# Altium schematic sheet Power.SchDoc
size A4
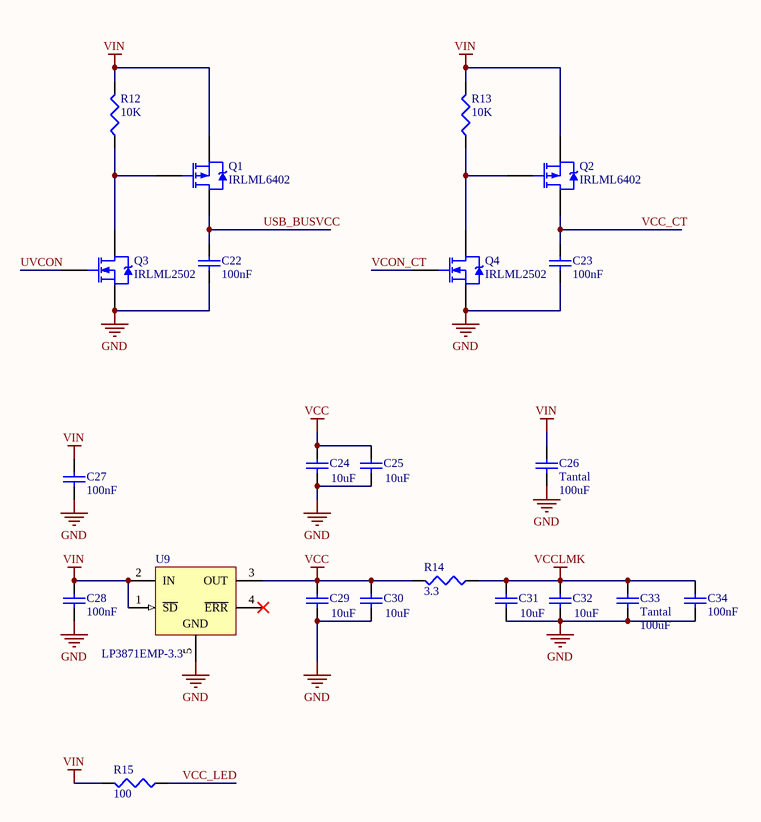
[diagram p0: Power.SchDoc]

## Parts
C22  100nF  [1608[0603]]
C23  100nF  [1608[0603]]
C24  10uF  [C1210]
C25  10uF  [C1210]
C26  Tantal  value 100uF  [C2512]
C27  100nF  [1608[0603]]
C28  100nF  [1608[0603]]
C29  10uF  [C1210]
C30  10uF  [C1210]
C31  10uF  [C1210]
C32  10uF  [C1210]
C33  Tantal  value 100uF  [C2512]
C34  100nF  [1608[0603]]
Q1  IRLML6402  [SOT-23_N]
Q2  IRLML6402  [SOT-23_N]
Q3  IRLML2502  [SOT-23_N]
Q4  IRLML2502  [SOT-23_N]
R12  10K  [J1-0603]
R13  10K  [J1-0603]
R14  3.3  [J1-0603]
R15  100  [J1-0603]
U9  LP3871EMP-3.3  [MP05A_N]

## Nets
GND: C22.2 C23.2 C24.1 C25.1 C26.1 C27.2 C28.2 C29.1 C30.1 C31.1 C32.1 C33.1 C34.2 Q3.2(S) Q4.2(S) U9.5(GND)
VCC: C24.2 C25.2 C29.2 C30.2 R14.2 U9.3(OUT)
VCCLMK: C31.2 C32.2 C33.2 C34.1 R14.1
VIN: C26.2 C27.1 C28.1 Q1.2(S) Q2.2(S) R12.2 R13.2 R15.2 U9.1(~{SD}) U9.2(IN)
USB_BUSVCC: C22.1 Q1.3(D)
UVCON: Q3.1(G)
VCC_CT: C23.1 Q2.3(D)
VCC_LED: R15.1
VCON_CT: Q4.1(G)
NetQ1_1: Q1.1(G) Q3.3(D) R12.1
NetQ2_1: Q2.1(G) Q4.3(D) R13.1

Not connected (* = marked no-connect by the designer): U9 4(~{ERR})*

## Library data of the parts
C22-C34 = Cap Semi: Capacitor (Semiconductor SIM Model); Published: 8-Jun-2000; LatestRevisionDate: 29-May-2009; LatestRevisionNote: IPC-7351 Footprint Added.; PackageReference: C1206; Publisher: Altium Limited; PackageDescription: Chip Capacitor
  C22 C23 C27 C28 C34: Value: 100nF
  C24 C25 C29-C32: Value: 10uF
Q1 Q2 = IRLML6302: HEXFET Power MOSFET; Published: 8-Jun-2000; LatestRevisionDate: 20-Nov-2009; LatestRevisionNote: IPC-7351 Footprint Added.; DatasheetVersion: Aug-1997; PackageReference: SOT-23; Publisher: Altium Limited; PackageDescription: 3-Pin SOT-23 Package 0.95 mm Pitch, 2.3 mm Lead Span; ComponentLink1Description: Manufacturer Link; ComponentLink1URL: http://www.irf.com/; ComponentLink2Description: Datasheet; ComponentLink2URL: http://www.irf.com/product-info/datasheets/data/irlml6302.pdf
Q3 Q4 = IRLML2402: HEXFET Power MOSFET; Published: 8-Jun-2000; LatestRevisionDate: 20-Nov-2009; LatestRevisionNote: IPC-7351 Footprint Added.; DatasheetVersion: Aug-1997; PackageReference: SOT-23; Publisher: Altium Limited; PackageDescription: 3-Pin SOT-23 Package 0.95 mm Pitch, 2.3 mm Lead Span; ComponentLink1Description: Manufacturer Link; ComponentLink1URL: http://www.irf.com/; ComponentLink2Description: Datasheet; ComponentLink2URL: http://www.irf.com/product-info/datasheets/data/irlml2402.pdf
R12-R15 = Res3: Resistor; Published: 8-Jun-2000; LatestRevisionDate: 29-May-2009; LatestRevisionNote: IPC-7351 Footprint Added.; PackageReference: J1-0603; Publisher: Altium Limited; PackageDescription: Chip Resistor
  R12 R13: Value: 10K
  R14: Value: 3.3
  R15: Value: 100
U9 = LP3871EMP-3.3: 0.8A Fast Ultra Low Dropout Linear Regulators, 5-pin SOT-223; Manufacturer: National Semiconductor; PackageTopMarking: XYTT*LH8B; PowerWise: N; CompType: LDO IC; Published: 4-Dec-2008; DatasheetVersion: Sep-2006; PackageVersion: revA, Jan-2000; PackageReference: MP05A; Publisher: Altium Limited; PackageDescription: Moldec SOT-223, 6.50 x 3.56 x 1.6mm Body, 5 Lead, 1.5mm Pitch; Supplier 1: Farnell; Supplier Part Number 1: 8188246; PartNumber: LP3871EMP-3.3; RoHS: N; PinCount: 5; Code_JEDEC: TO-261-AB; Code_IPC: SOT223-5; ComponentLink1Description: LP3871 Datasheet; ComponentLink1URL: http://www.national.com/ds/LP/LP3871.pdf; ComponentLink2Description: LP3871 Web Page; ComponentLink2URL: http://www.national.com/pf/LP/LP3871.html; ComponentLink3Description: MP05A Package Page; ComponentLink3URL: http://www.national.com/packaging/folders/mp05a.html